# EasyEDA schematic schematic.json
TITLE: Jubilee line power button; REV: 1.0; Date: 2018-08-27; Sheet: 1/1; Drawn By: grand.edgemaster
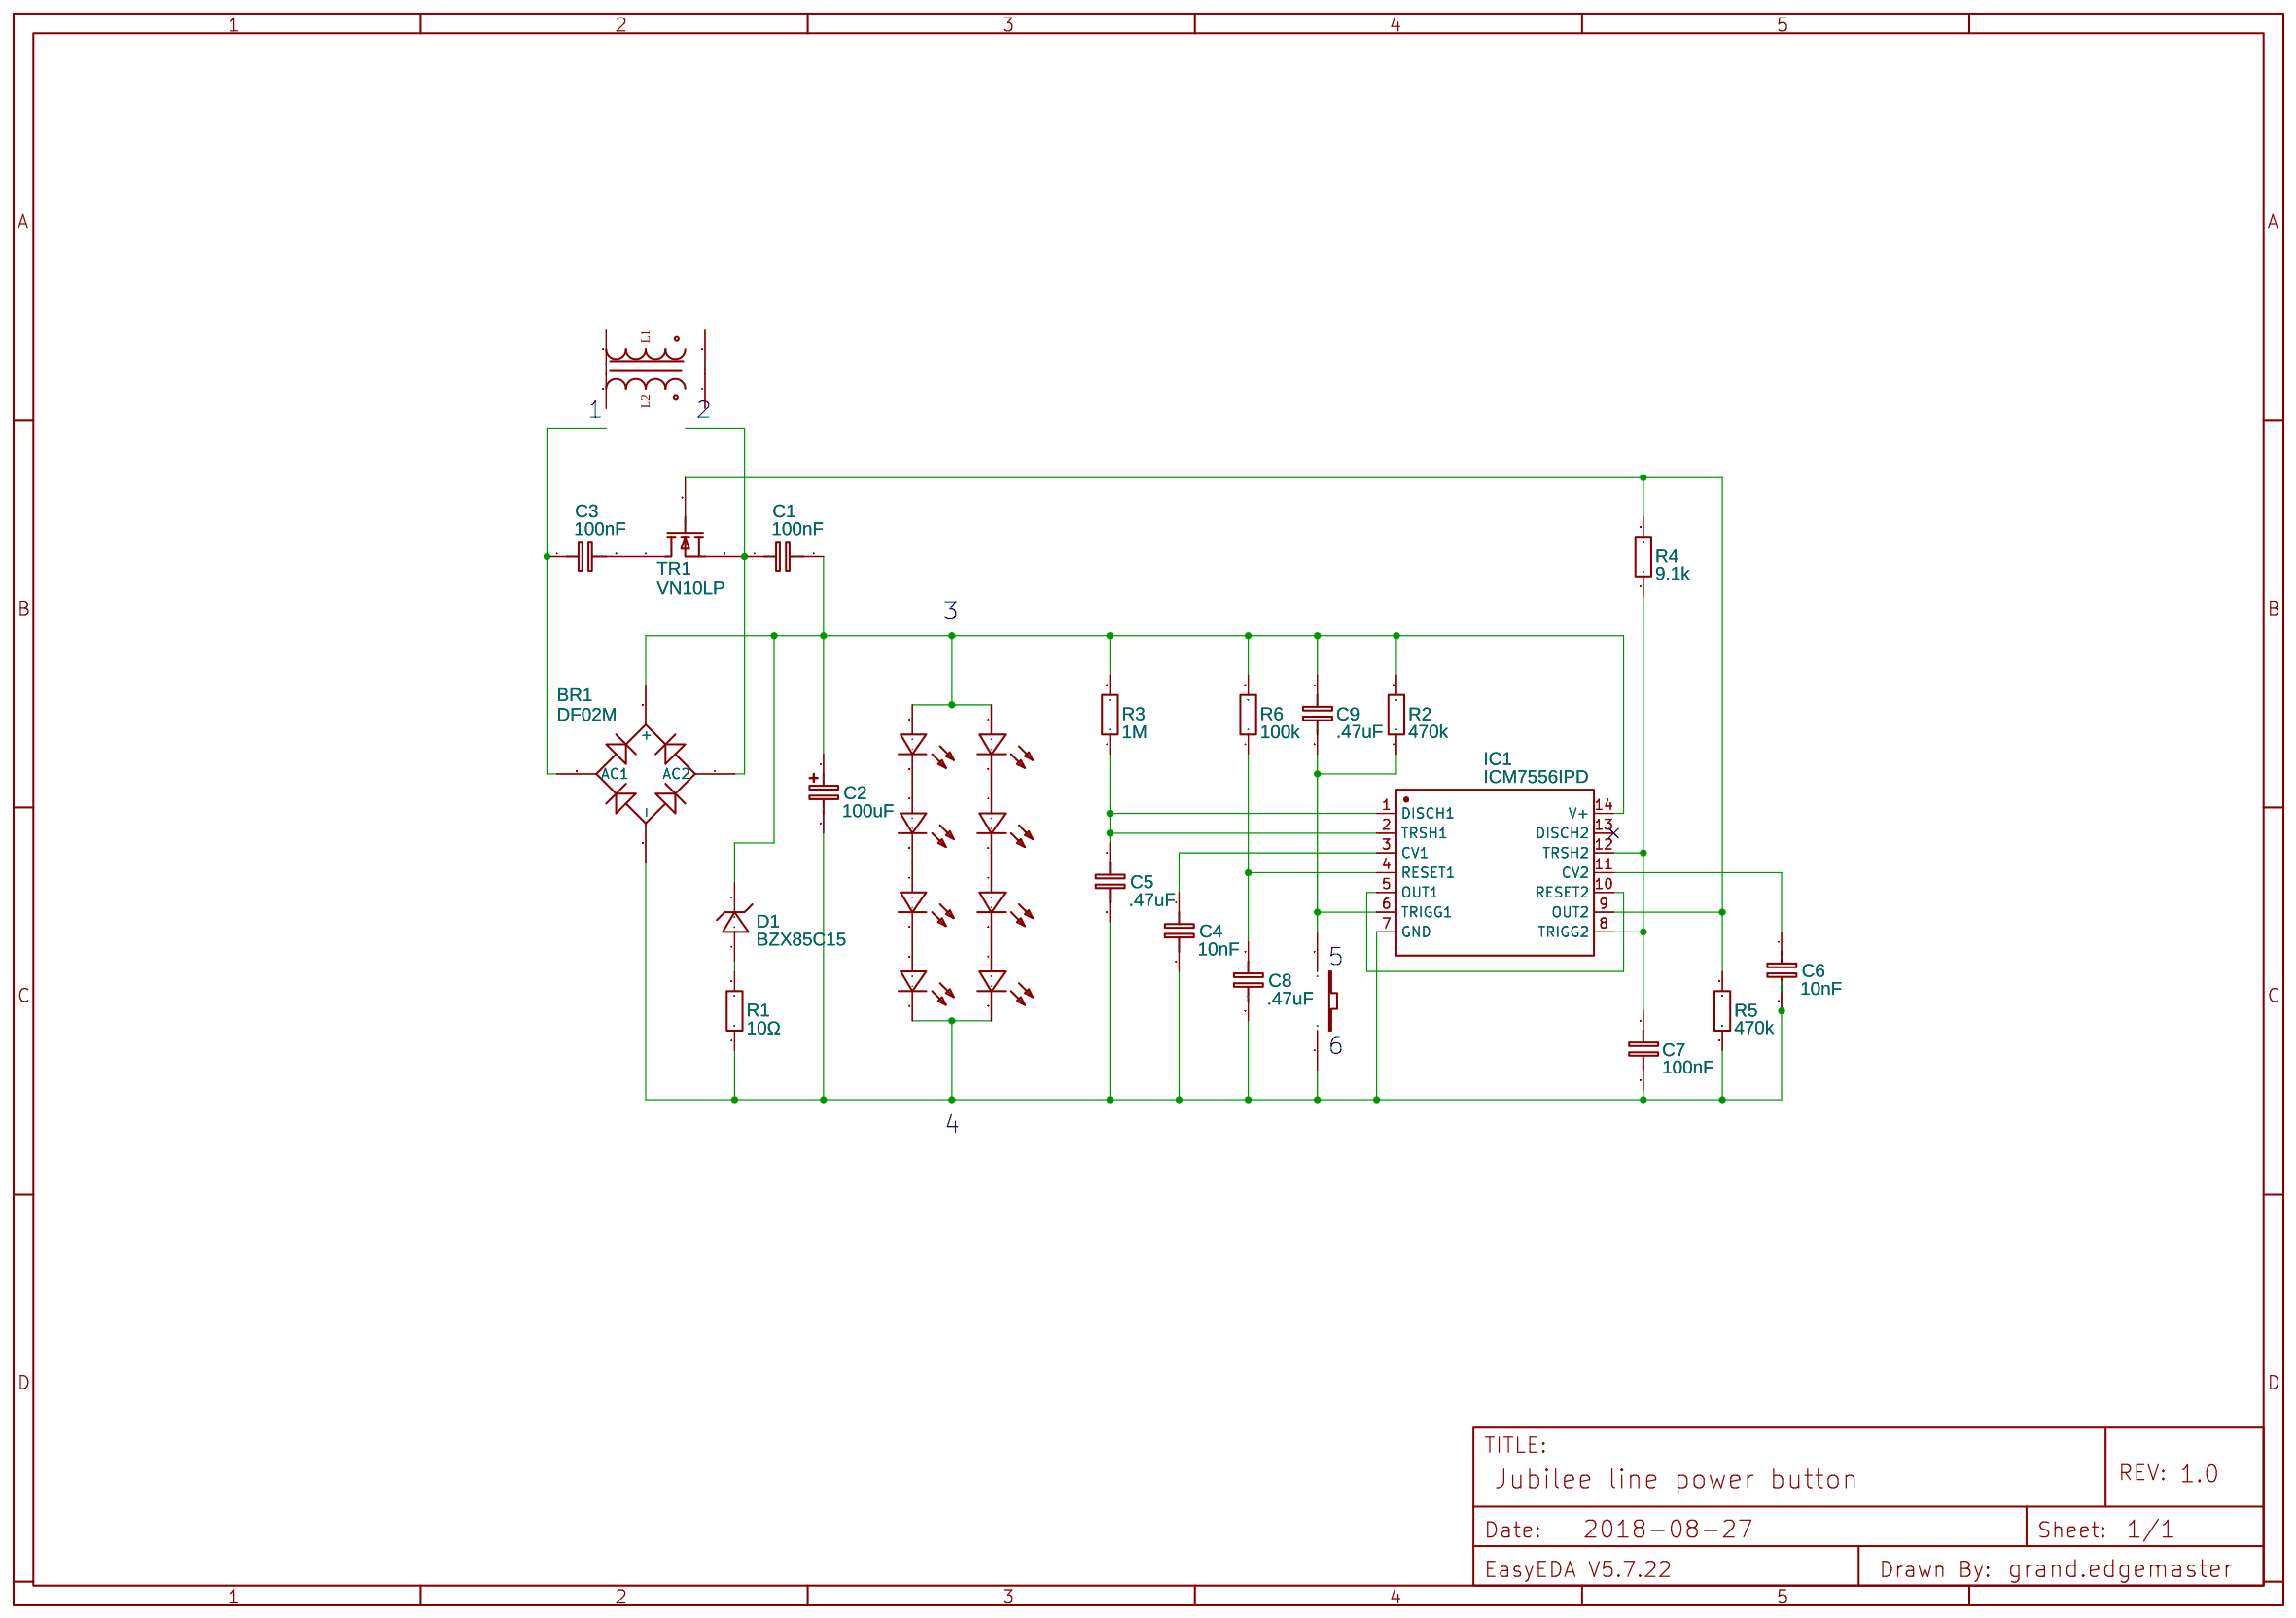
[diagram p0: schematic sheet]

## Parts
BR1  DF02M  [DB-DIP-8_M]
C1  100nF  [RAD-0.1]
C2  100uF  [AXIAL_CAPACITOR 12X5MM]
C3  100nF  [RAD-0.1]
C4  10nF  [RAD-0.1]
C5  .47uF  [RAD-0.1]
C6  10nF  [RAD-0.1]
C7  100nF  [RAD-0.1]
C8  .47uF  [RAD-0.1]
C9  .47uF  [RAD-0.1]
D1  BZX85C15  [DO-41]
IC1  ICM7556IPD  [DIP14]
LED  LED-3MM  [LED-3MM/2.54]
LED2  LED-3MM  [LED-3MM/2.54]
LED3  LED-3MM  [LED-3MM/2.54]
LED4  LED-3MM  [LED-3MM/2.54]
LED5  LED-3MM  [LED-3MM/2.54]
LED6  LED-3MM  [LED-3MM/2.54]
LED7  LED-3MM  [LED-3MM/2.54]
LED8  LED-3MM  [LED-3MM/2.54]
R1  10Ω  [AXIAL-0.3]
R2  470k  [AXIAL-0.3]
R3  1M  [AXIAL-0.3]
R4  9.1k  [AXIAL-0.3]
R5  470k  [AXIAL-0.3]
R6  100k  [AXIAL-0.3]
SW1  Button
T1  Mutual_Inductors  [TRANSFORMER]
TR1  VN10LP  [E3]

## Library data of the parts
BR1 = -: Contributor: rbhar
C1 C3-C9 = Cap_RAD-0.1_EU: Manufacturer Part: ?
C2 = Cap_Electrolytic(TH)_D3.0XF1.5_EU: Contributor: EasyEDA
IC1 = -: Manufacturer Part: Maxim
LED5 = -: Mounted: Yes
R1-R6 = Res_AXIAL-0.3(1/8W)_EU: Manufacturer Part: ?
SW1 = -: Contributor: LCSC; Mounted: Yes
T1 = MUTUAL_INDUCTORS: Rs1: 1u; Rs2: 1u; L1: 1; L2: 2; K: 1; Contributor: EasyEDA; Manufacturer Part: ?; Mounted: Yes
TR1 = -: N-Channel Enhancement Mode Vertical DMOS FET; Manufacturer Part: ?

## Nets
Net-(BR1-1): BR1.1(+) C1.2 C2.1 C9.1 D1.2(K) IC1.14(V+) LED.1(+) LED3.1(+) R2.2 R3.2 R6.2
Net-(BR1-2): BR1.2(-) C2.2 C4.2 C5.2 C6.2 C7.2 C8.2 IC1.7(GND) LED5.2(-) LED8.2(-) R1.1 R5.1 SW1.2
Net-(BR1-3): BR1.3(AC1) C3.1 T1.3
Net-(BR1-4): BR1.4(AC2) C1.1 T1.4 TR1.3(S)
Net-(C3-2): C3.2 TR1.1(D)
Net-(C4-1): C4.1 IC1.3(CV1)
Net-(C5-1): C5.1 IC1.1(DISCH1) IC1.2(TRSH1) R3.1
Net-(C6-1): C6.1 IC1.11(CV2)
Net-(C7-1): C7.1 IC1.8(TRIGG2) IC1.12(TRSH2) R4.1
Net-(C8-1): C8.1 IC1.4(RESET1) R6.1
Net-(C9-2): C9.2 IC1.6(TRIGG1) R2.1 SW1.1
Net-(D1-1): D1.1(A) R1.2
Net-(IC1-5): IC1.5(OUT1) IC1.10(RESET2)
Net-(IC1-9): IC1.9(OUT2) R4.2 R5.2 TR1.2(G)
Net-(LED2-1): LED2.1(+) LED3.2(-)
Net-(LED2-2): LED2.2(-) LED7.1(+)
Net-(LED4-1): LED4.1(+) LED6.2(-)
Net-(LED4-2): LED4.2(-) LED5.1(+)
Net-(LED7-2): LED7.2(-) LED8.1(+)
Net-(LED-2): LED.2(-) LED6.1(+)

Not connected (* = marked no-connect by the designer): IC1 13(DISCH2)*; T1 1 2

## Notes on the sheet
- 1
- 2
- 3
- 5
- 6
- 4
